# EAGLE design untitled (EAGLE 6.6.0)
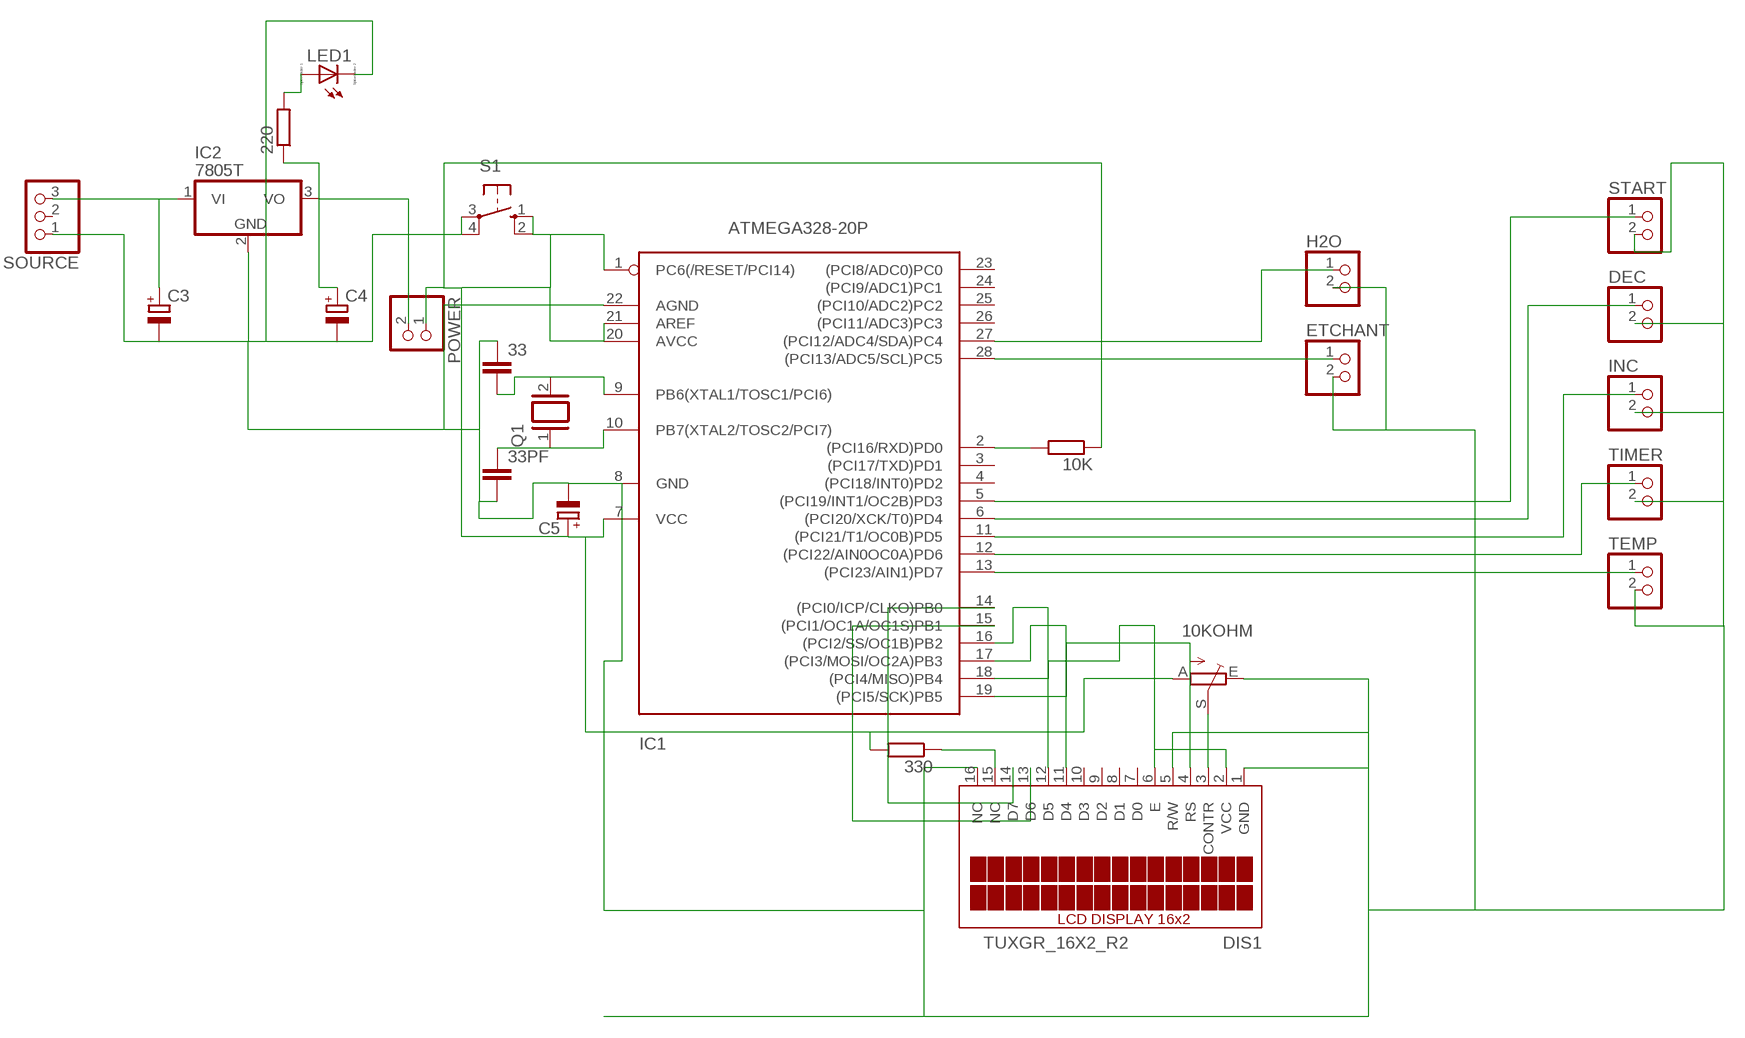
[diagram p0: schematic, sheet 1]

## Parts
10K  R-EU_0204/7  [0204/7]
10KOHM  TRIM_EU-CA6V  [CA6V]
33  C-EU025-030X050  [C025-030X050]
33PF  C-EU025-030X050  [C025-030X050]
220  R-EU_0204/7  [0204/7]
330  R-EU_0204/7  [0204/7]
C3  CPOL-EUE2.5-7  [E2,5-7]
C4  CPOL-EUE2.5-7  [E2,5-7]
C5  CPOL-EUE2.5-7  [E2,5-7]
DEC  PINHD-1X2  [1X02]
DIS1  TUXGR_16X2_R2  [TUXGR_16X2_R2]
ETCHANT  PINHD-1X2  [1X02]
H2O  PINHD-1X2  [1X02]
IC1  ATMEGA328-20P  [DIL28-3]
IC2  7805T  [TO220H]
INC  PINHD-1X2  [1X02]
LED1  LED_ELD260  [LED_LD260]
POWER  PINHD-1X2  [1X02]
Q1  XTAL  [Q]
S1  10-XX  [B3F-10XX]
SOURCE  PINHD-1X3  [1X03]
START  PINHD-1X2  [1X02]
TEMP  PINHD-1X2  [1X02]
TIMER  PINHD-1X2  [1X02]

## Nets
GND: 10KOHM.E 33.1 33PF.2 C3.- C4.- C5.- DEC.2 DIS1.1(GND) DIS1.5(R/W) DIS1.16(NC) ETCHANT.2 H2O.2 IC1.8(GND) IC1.22(AGND) IC2.2(GND) INC.2 LED1.K(C) S1.3(P) S1.4(P1) SOURCE.1 START.2 TEMP.2 TIMER.2
N$1: C3.+ IC2.1(VI) SOURCE.3
N$2: 10KOHM.S DIS1.3(CONTR)
N$3: 220.1 C4.+ IC2.3(VO) POWER.2
N$4: 220.2 LED1.A
N$6: 10K.1 10KOHM.A 330.2 C5.+ DIS1.2(VCC) IC1.1(PC6(/RESET/PCI14)) IC1.7(VCC) IC1.20(AVCC) IC1.21(AREF) POWER.1 S1.1(S) S1.2(S1)
N$8: 33.2 IC1.9(PB6(XTAL1/TOSC1/PCI6)) Q1.2
N$9: 33PF.1 IC1.10(PB7(XTAL2/TOSC2/PCI7)) Q1.1
N$13: 10K.2 IC1.2((PCI16/RXD)PD0)
N$16: 330.1 DIS1.15(NC)
N$17: DIS1.4(RS) IC1.19((PCI5/SCK)PB5)
N$18: DIS1.6(E) IC1.18((PCI4/MISO)PB4)
N$19: DIS1.11(D4) IC1.17((PCI3/MOSI/OC2A)PB3)
N$20: DIS1.12(D5) IC1.16((PCI2/SS/OC1B)PB2)
N$21: DIS1.13(D6) IC1.15((PCI1/OC1A/OC1S)PB1)
N$22: DIS1.14(D7) IC1.14((PCI0/ICP/CLKO)PB0)
N$24: IC1.13((PCI23/AIN1)PD7) TEMP.1
N$25: IC1.12((PCI22/AIN0OC0A)PD6) TIMER.1
N$26: IC1.11((PCI21/T1/OC0B)PD5) INC.1
N$27: DEC.1 IC1.6((PCI20/XCK/T0)PD4)
N$28: IC1.5((PCI19/INT1/OC2B)PD3) START.1
N$30: ETCHANT.1 IC1.28((PCI13/ADC5/SCL)PC5)
N$31: H2O.1 IC1.27((PCI12/ADC4/SDA)PC4)
Unconnected: DIS1.7(D0) DIS1.8(D1) DIS1.9(D2) DIS1.10(D3) IC1.3((PCI17/TXD)PD1) IC1.4((PCI18/INT0)PD2) IC1.23((PCI8/ADC0)PC0) IC1.24((PCI9/ADC1)PC1) IC1.25((PCI10/ADC2)PC2) IC1.26((PCI11/ADC3)PC3) SOURCE.2

## Library data of the parts
10K 220 330 = resistor:R-EU_: RESISTOR, European symbol
10KOHM = pot:TRIM_EU-: POTENTIOMETER
33 33PF = rcl:C-EU: CAPACITOR, European symbol
C3-C5 = rcl:CPOL-EU: POLARIZED CAPACITOR, European symbol
DEC ETCHANT H2O INC POWER START TEMP TIMER = pinhead:PINHD-1X2: PIN HEADER
DIS1 = display-lcd:TUXGR_16X2_R2: Tuxgraphics LCD display 16x2 characters reflective, without background light Source: tuxgr_12x2_r2.pdf; OC_FARNELL: unknown; OC_NEWARK: unknown
IC1 = atmega328:ATMEGA328*P: MICROCONTROLLER 32 kBytes FLASH 2 kBytes SRAM 1 kBytes EEPROM USART 8-channel 10 bit ADC
IC2 = linear:78*: Positive VOLTAGE REGULATOR Source: http://cache.national.com/ds/LM/LM78L05.pdf http://www.fairchildsemi.com/ds/LM/LM7805.pdf
LED1 = eagle-ltspice:LED_E: LED Source: http://www.osram.convergy.de Source: www.luxeon.com Source: www.kingbright.com; SPICEMODEL: NONE; SPICEPREFIX: D; SPICETYPE: diode
Q1 = special:XTAL: CRYSTAL
S1 = switch-omron:10-XX: OMRON SWITCH; MPN: B3F-1000; OC_FARNELL: 176432; OC_NEWARK: 36M3542
SOURCE = pinhead:PINHD-1X3: PIN HEADER

## Board
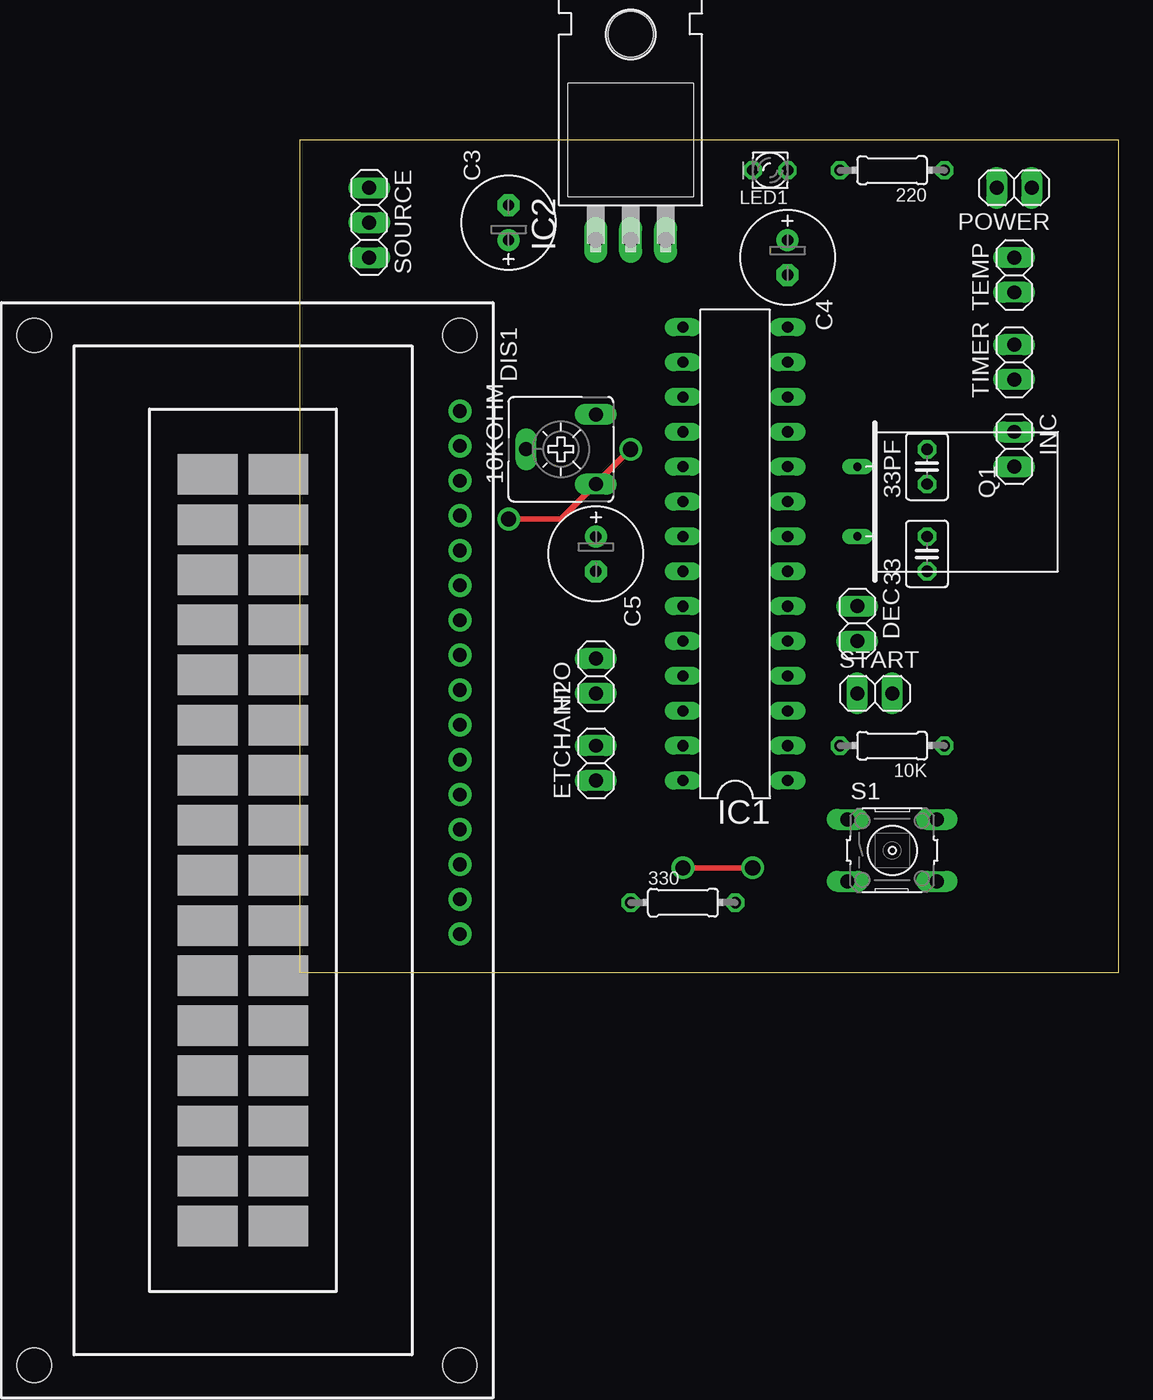
[diagram p1: board, top side]
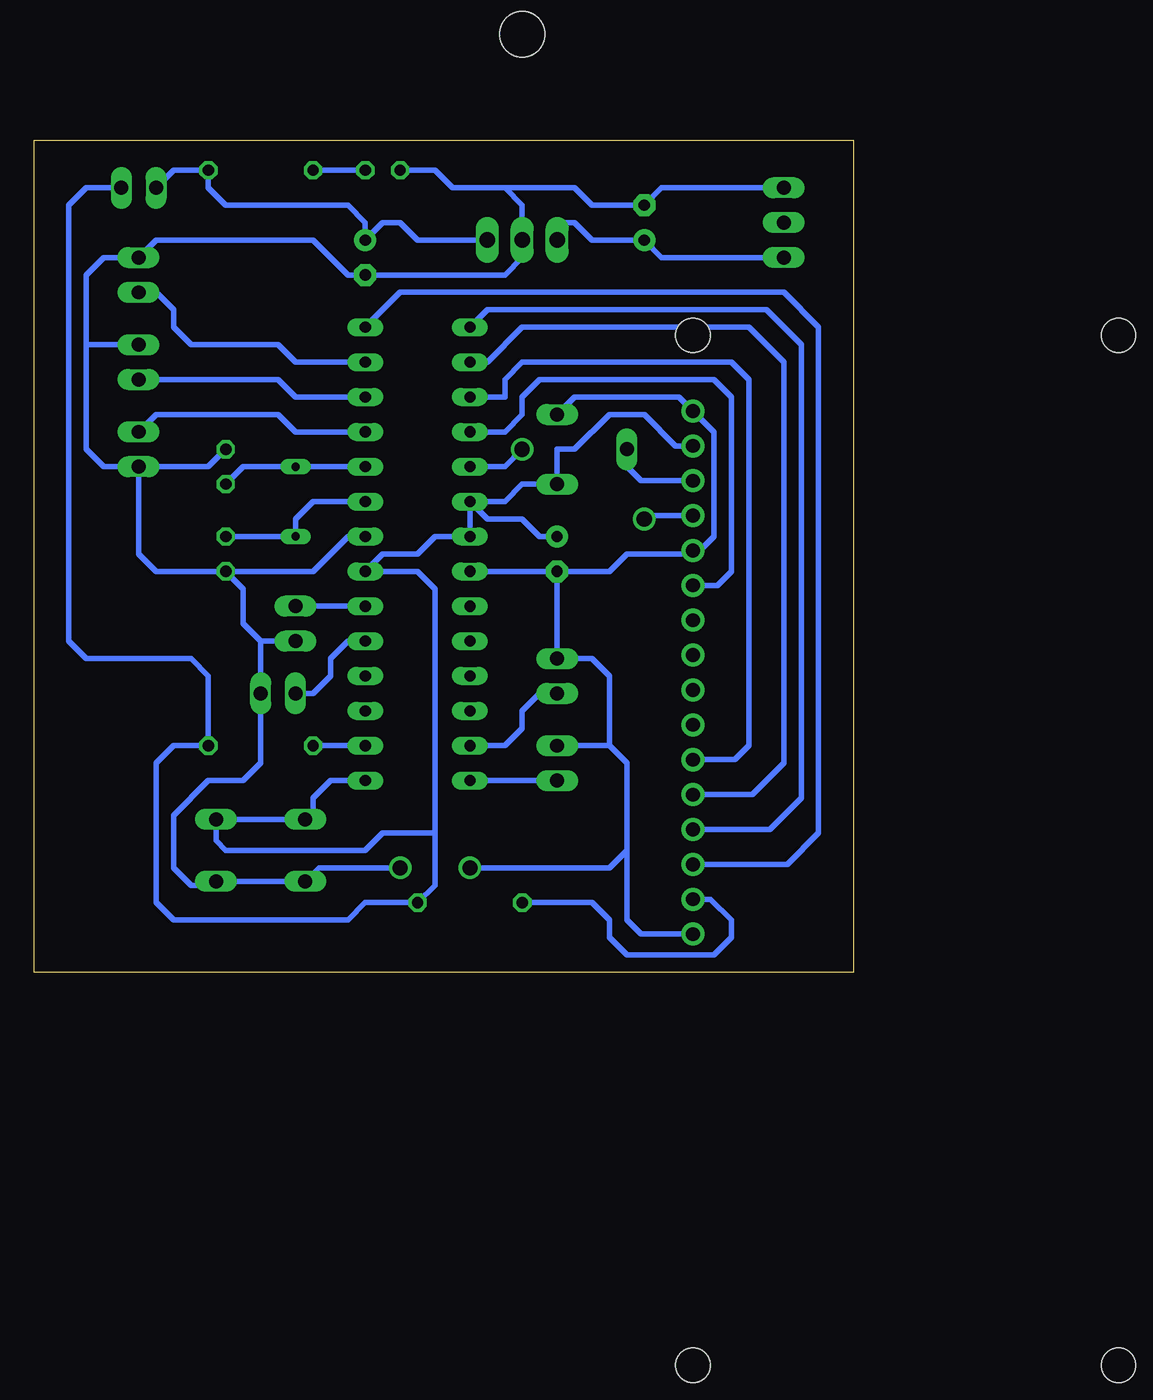
[diagram p2: board, bottom side, seen from below]

Size 59.67 x 60.63 mm. Coordinates in mm from the lower left corner, seen from the top.
Outline: 0,0 59.67,0 59.67,60.63 0,60.63 0,0
Copper layers (1*16): Top 0.035mm / dielectric 1.5mm / Bottom 0.035mm
Design rules "default": minimum track width 10mil, minimum drill 24mil, track to track 8mil, track to pad 8mil, pad to pad 8mil, via to via 8mil, smd to smd 8mil, copper to edge 40mil, drill to drill 8mil, minimum pad ring 10mil, minimum via ring 8mil, stop-mask expansion 4mil, vias tented up to drill 0mil, thermal gap 10mil

### Footprints (pad centres in the part's own frame; a part is rotated, then mirrored left to right if it is on the bottom)
0204/7 = drill 0.813 octagon: 1 -3.81,0; 2 3.81,0
CA6V = drill 1.016 long: A -2.54,-2.54; E 2.54,-2.54; S 0,2.54
C025-030X050 = drill 0.813 octagon: 1 -1.27,0; 2 1.27,0
E2,5-7 = drill 0.813 pad 1.6: + -1.27,0 | drill 0.813 pad 1.6 octagon: - 1.27,0
1X02 = drill 1.016 long: 1 -1.27,0; 2 1.27,0
TUXGR_16X2_R2 = drill 1 pad 1.676: 1 -32,15.5; 2 -29.46,15.5; 3 -26.92,15.5; 4 -24.38,15.5; 5 -21.84,15.5; 6 -19.3,15.5; 7 -16.76,15.5; 8 -14.22,15.5; 9 -11.68,15.5; 10 -9.14,15.5; 11 -6.6,15.5; 12 -4.06,15.5; 13 -1.52,15.5; 14 1.02,15.5; 15 3.56,15.5; 16 6.1,15.5 | hole 2.5: -37.5,-15.5; 37.5,-15.5; -37.5,15.5; 37.5,15.5
DIL28-3 = drill 0.813 long: 1 -16.51,-3.81; 2 -13.97,-3.81; 3 -11.43,-3.81; 4 -8.89,-3.81; 5 -6.35,-3.81; 6 -3.81,-3.81; 7 -1.27,-3.81; 8 1.27,-3.81; 9 3.81,-3.81; 10 6.35,-3.81; 11 8.89,-3.81; 12 11.43,-3.81; 13 13.97,-3.81; 14 16.51,-3.81; 15 16.51,3.81; 16 13.97,3.81; 17 11.43,3.81; 18 8.89,3.81; 19 6.35,3.81; 20 3.81,3.81; 21 1.27,3.81; 22 -1.27,3.81; 23 -3.81,3.81; 24 -6.35,3.81; 25 -8.89,3.81; 26 -11.43,3.81; 27 -13.97,3.81; 28 -16.51,3.81
TO220H = drill 1.118 long: 1 -2.54,-10.16; 2 0,-10.16; 3 2.54,-10.16 | hole 3.302: 0,4.826
LED_LD260 = drill 0.813 octagon: A -1.27,0; K 1.27,0
Q = drill 0.61 long: 1 -2.54,-7.62; 2 2.54,-7.62
B3F-10XX = drill 1.016 long: 1 -3.251,2.261; 2 3.251,2.261; 3 -3.251,-2.261; 4 3.251,-2.261
1X03 = drill 1.016 long: 1 -2.54,0; 2 0,0; 3 2.54,0

### Placement (x,y rotation side)
10K  43.18,16.51 180 top
10KOHM  19.05,38.1 90 top
33  45.72,30.48 90 top
33PF  45.72,36.83 90 top
220  43.18,58.42 180 top
330  27.94,5.08 0 top
C3  15.24,54.61 90 top
C4  35.56,52.07 270 top
C5  21.59,30.48 270 top
DEC  40.64,25.4 270 top
DIS1  -3.81,8.89 270 top
ETCHANT  21.59,15.24 90 top
H2O  21.59,21.59 90 top
IC1  31.75,30.48 90 top
IC2  24.13,63.5 0 top
INC  52.07,38.1 270 top
LED1  34.29,58.42 180 top
POWER  52.07,57.15 180 top
Q1  48.26,34.29 270 top
S1  43.18,8.89 0 top
SOURCE  5.08,54.61 270 top
START  41.91,20.32 0 top
TEMP  52.07,50.8 90 top
TIMER  52.07,44.45 90 top

### Tracks (layer width: path | path; a pad name or v marks a point on that pad's centre or on a via)
GND  (via drill 1.1)
  Top 0.406: v27.94,7.62 v33.02,7.62
  Bottom 0.406: SOURCE.1 13.97,57.15 C3.- 19.05,55.88 20.32,57.15 25.4,57.15 | LED1.K 30.48,58.42 29.21,57.15 25.4,57.15 | 25.4,57.15 24.13,55.88 IC2.2 24.13,52.07 25.4,50.8 C4.- 36.83,50.8 39.37,53.34 50.8,53.34 TEMP.2 54.61,52.07 55.88,50.8 55.88,45.72 | 55.88,45.72 55.88,38.1 54.61,36.83 INC.2 | TIMER.2 55.88,45.72 | INC.2 46.99,36.83 33PF.2 | INC.2 52.07,30.48 50.8,29.21 33.1 | DEC.2 43.18,24.13 | 43.18,24.13 44.45,25.4 44.45,27.94 33.1 | 11.94,30.48 DIS1.5 11.18,30.73 | 10.16,39.36 10.16,31.75 11.18,30.73 | 10.16,39.36 DIS1.1 | 43.18,24.13 START.2 43.18,15.24 44.45,13.97 46.99,13.97 49.53,11.43 49.53,7.62 48.26,6.35 46.71,6.35 S1.4 S1.3 38.94,7.62 v33.02,7.62 | DIS1.16 15.49,2.79 16.51,3.81 16.51,8.89 | 17.78,16.51 ETCHANT.2 | IC1.8 36.83,31.75 39.37,29.21 33.1 | C5.- 17.78,29.21 16.51,30.48 11.94,30.48 | 11.94,30.48 11.43,30.48 11.18,30.73 | DIS1.1 10.16,39.37 10.16,39.36 | DIS1.1 12.7,41.91 20.32,41.91 10KOHM.E | IC1.22 C5.- | C5.- H2O.2 19.05,22.86 17.78,21.59 17.78,16.51 | 17.78,16.51 16.51,15.24 16.51,8.89 | 16.51,8.89 17.78,7.62 v27.94,7.62
N$1
  Bottom 0.406: SOURCE.3 13.97,52.07 C3.+ 19.05,53.34 20.32,54.61 21.59,54.61 IC2.1
N$2
  Bottom 0.406: DIS1.3 15.49,35.81 16.51,36.83 10KOHM.S
N$3
  Bottom 0.406: IC2.3 31.75,53.34 33.02,54.61 34.29,54.61 C4.+ 35.56,54.61 36.83,55.88 45.72,55.88 46.99,57.15 220.1 49.53,58.42 POWER.2
N$4
  Bottom 0.406: LED1.A 220.2
N$5  (via drill 1.1)
  other vias: 33.02,7.62
N$6
  Bottom 0.406: IC1.1 38.1,13.97 39.37,12.7 39.37,11.71 S1.1 S1.2 46.43,9.6 45.72,8.89 35.56,8.89 34.29,10.16 30.48,10.16 | IC1.20 IC1.21 30.48,31.75 31.75,30.48 34.29,30.48 IC1.7 31.75,29.21 30.48,27.94 30.48,10.16 | C5.+ 22.86,31.75 24.13,33.02 26.67,33.02 IC1.20 | POWER.1 55.88,57.15 57.15,55.88 57.15,24.13 55.88,22.86 48.26,22.86 46.99,21.59 10K.1 49.53,16.51 50.8,15.24 50.8,5.08 49.53,3.81 36.83,3.81 35.56,5.08 330.2 30.48,6.35 30.48,10.16 | DIS1.2 12.95,38.35 15.24,40.64 17.78,40.64 20.32,38.1 21.59,38.1 10KOHM.A 24.13,35.56 25.4,34.29 IC1.20
N$8
  Bottom 0.406: IC1.9 39.37,34.29 40.64,33.02 Q1.2 33.2
N$9
  Bottom 0.406: IC1.10 Q1.1 44.45,36.83 33PF.1
N$13
  Bottom 0.406: IC1.2 10K.2
N$16
  Bottom 0.406: DIS1.15 10.41,5.33 8.89,3.81 8.89,2.54 10.16,1.27 16.51,1.27 17.78,2.54 17.78,3.81 19.05,5.08 330.1
N$17  (via drill 1.1)
  Top 0.406: v15.24,33.02 19.05,33.02 v24.13,38.1
  Bottom 0.406: DIS1.4 14.99,33.27 v15.24,33.02 | v24.13,38.1 25.4,36.83 IC1.19
N$18
  Bottom 0.406: DIS1.6 9.91,28.19 8.89,29.21 8.89,41.91 10.16,43.18 22.86,43.18 24.13,41.91 24.13,40.64 25.4,39.37 IC1.18
N$19
  Bottom 0.406: DIS1.11 8.64,15.49 7.62,16.51 7.62,43.18 8.89,44.45 24.13,44.45 25.4,43.18 25.4,41.91 IC1.17
N$20
  Bottom 0.406: DIS1.12 7.37,12.95 5.08,15.24 5.08,44.45 7.62,46.99 24.13,46.99 26.67,44.45 IC1.16
N$21
  Bottom 0.406: DIS1.13 6.1,10.41 3.81,12.7 3.81,45.72 6.35,48.26 26.67,48.26 IC1.15
N$22
  Bottom 0.406: DIS1.14 4.83,7.87 2.54,10.16 2.54,46.99 5.08,49.53 33.02,49.53 IC1.14
N$24
  Bottom 0.406: IC1.13 40.64,44.45 41.91,45.72 48.26,45.72 49.53,46.99 49.53,48.26 50.8,49.53 TEMP.1
N$25
  Bottom 0.406: IC1.12 40.64,41.91 41.91,43.18 TIMER.1
N$26
  Bottom 0.406: IC1.11 40.64,39.37 41.91,40.64 50.8,40.64 INC.1
N$27
  Bottom 0.406: IC1.6 DEC.1
N$28
  Bottom 0.406: IC1.5 36.83,24.13 38.1,22.86 38.1,21.59 39.37,20.32 START.1
N$30
  Bottom 0.406: ETCHANT.1 IC1.28
N$31
  Bottom 0.406: H2O.1 22.86,20.32 24.13,19.05 24.13,17.78 25.4,16.51 IC1.27